# EAGLE design ESP32 (EAGLE 9.6.2)
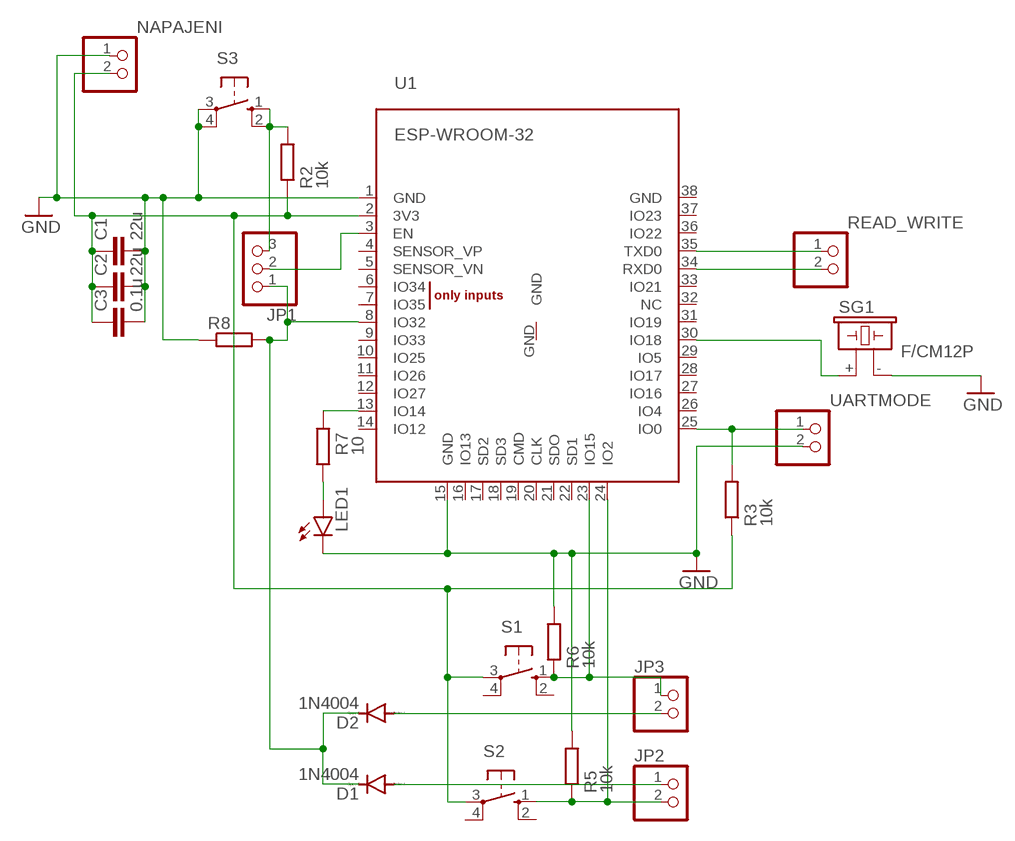
[diagram p0: schematic, sheet 1]

## Parts
C1  22u  C2.5/2  [C2.5-2]
C2  22u  C2.5/2  [C2.5-2]
C3  0.1u  C2.5/2  [C2.5-2]
D1  1N4004  [DO41-10]
D2  1N4004  [DO41-10]
JP1  PINHD-1X3  [1X03]
JP2  PINHD-1X2  [1X02]
JP3  PINHD-1X2  [1X02]
LED1  LED5MM  [LED5MM]
NAPAJENI  PINHD-1X2  [1X02]
R2  10k  R-EU_0207/10  [0207/10]
R3  10k  R-EU_0207/10  [0207/10]
R5  10k  R-EU_0207/10  [0207/10]
R6  10k  R-EU_0207/10  [0207/10]
R7  10  R-EU_0207/10  [0207/10]
R8  R-EU_0207/10  [0207/10]
READ_WRITE  PINHD-1X2  [1X02]
S1  10-XX  [B3F-10XX]
S2  10-XX  [B3F-10XX]
S3  10-XX  [B3F-10XX]
SG1  F/CM12P  [F/CM12P]
U1  ESP-WROOM-32  [ESP-WROOM-32]
UARTMODE  PINHD-1X2  [1X02]

## Nets
GND: C1.2 C2.2 C3.2 LED1.K(C) NAPAJENI.1 R5.2 R6.2 R8.1 S3.3(P) S3.4(P1) SG1.- U1.1(GND) U1.15(GND) UARTMODE.2
N$1: SG1.+ U1.30(IO18)
N$2: C1.1 C2.1 C3.1 NAPAJENI.2 R2.1 R3.1 S1.3(P) S2.3(P) U1.2(3V3)
N$3: JP1.3 R2.2 S3.1(S) S3.2(S1)
N$5: JP1.2 U1.3(EN)
N$6: READ_WRITE.2 U1.34(RXD0)
N$7: READ_WRITE.1 U1.35(TXD0)
N$8: R3.2 U1.25(IO0) UARTMODE.1
N$11: JP2.2 R5.1 S2.1(S) U1.24(IO2)
N$12: JP3.1 R6.1 S1.1(S) U1.23(IO15)
N$13: R7.2 U1.13(IO14)
N$14: LED1.A R7.1
N$15: D1.C D2.C JP1.1 R8.2 U1.8(IO32)
N$17: D1.A JP2.1
N$18: D2.A JP3.2
Unconnected: S1.2(S1) S1.4(P1) S2.2(S1) S2.4(P1) U1.4(SENSOR_VP) U1.5(SENSOR_VN) U1.6(IO34) U1.7(IO35) U1.9(IO33) U1.10(IO25) U1.11(IO26) U1.12(IO27) U1.14(IO12) U1.16(IO13) U1.17(SD2) U1.18(SD3) U1.19(CMD) U1.20(CLK) U1.21(SDO) U1.22(SD1) U1.26(IO4) U1.27(IO16) U1.28(IO17) U1.29(IO5) U1.31(IO19) U1.32(NC) U1.33(IO21) U1.36(IO22) U1.37(IO23) U1.38(GND) U1.GND

## Library data of the parts
C1-C3 = capacitor-wima:C: CAPACITOR naming: grid - package width
D1 D2 = diode:1N4004: DIODE general purpose rectifier, 1 A
JP1 = pinhead:PINHD-1X3: PIN HEADER
JP2 JP3 NAPAJENI READ_WRITE UARTMODE = pinhead:PINHD-1X2: PIN HEADER
LED1 = led:LED: LED OSRAM: - CHIPLED LG R971, LG N971, LY N971, LG Q971, LY Q971, LO R971, LY R971 LH N974, LH R974 LS Q976, LO Q976, LY Q976 LO Q996 - Hyper CHIPLED LW Q18S LB Q993, LB Q99A, LB R99A - SideLED LS A670, LO A670, LY A670, LG A670, LP A670 LB A673, LV A673, LT A673, LW A673 LH A674 LY A675 LS A676, LA A676, LO A676, LY A676, LW A676 LS A679, LY A679, LG A679 - Hyper Micro SIDELED® LS Y876, LA Y876, LO Y876, LY Y876 LT Y87S - SmartLED LW L88C, LW L88S LB L89C, LB L89S, LG L890 LS L89K, LO L89K, LY L89K LS L896, LA L896, LO L896, LY L896 - TOPLED LS T670, LO T670, LY T670, LG T670, LP T670 LSG T670, LSP T670, LSY T670, LOP T670, LYG T670 LG T671, LOG T671, LSG T671 LB T673, LV T673, LT T673, LW T673 LH T674 LS T676, LA T676, LO T676, LY T676, LB T676, LH T676, LSB T676, LW T676 LB T67C, LV T67C, LT T67C, LS T67K, LO T67K, LY T67K, LW E67C LS E67B, LA E67B, LO E67B, LY E67B, LB E67C, LV E67C, LT E67C LW T67C LS T679, LY T679, LG T679 LS T770, LO T770, LY T770, LG T770, LP T770 LB T773, LV T773, LT T773, LW T773 LH T774 LS E675, LA E675, LY E675, LS T675 LS T776, LA T776, LO T776, LY T776, LB T776 LHGB T686 LT T68C, LB T68C - Hyper Mini TOPLED® LB M676 - Mini TOPLED Santana® LG M470 LS M47K, LO M47K, LY M47K Source: http://www.osram.convergy.de LUXEON: - LUMILED® LXK2-PW12-R00, LXK2-PW12-S00, LXK2-PW14-U00, LXK2-PW14-V00 LXK2-PM12-R00, LXK2-PM12-S00, LXK2-PM14-U00 LXK2-PE12-Q00, LXK2-PE12-R00, LXK2-PE12-S00, LXK2-PE14-T00, LXK2-PE14-U00 LXK2-PB12-K00, LXK2-PB12-L00, LXK2-PB12-M00, LXK2-PB14-N00, LXK2-PB14-P00, LXK2-PB14-Q00 LXK2-PR12-L00, LXK2-PR12-M00, LXK2-PR14-Q00, LXK2-PR14-R00 LXK2-PD12-Q00, LXK2-PD12-R00, LXK2-PD12-S00 LXK2-PH12-R00, LXK2-PH12-S00 LXK2-PL12-P00, LXK2-PL12-Q00, LXK2-PL12-R00 Source: www.luxeon.com KINGBRIGHT: KA-3528ASYC Source: www.kingbright.com
R2 R3 R5-R8 = rcl:R-EU_: RESISTOR, European symbol; SPICEPREFIX: R
S1-S3 = switch-omron:10-XX: OMRON SWITCH; MPN: B3F-1000; OC_FARNELL: 176432; OC_NEWARK: 36M3542
SG1 = buzzer:F/CM12P: BUZZER Source: Buerklin; OC_FARNELL: unknown; OC_NEWARK: unknown
U1 = ESP32:ESP-WROOM-32

## Board
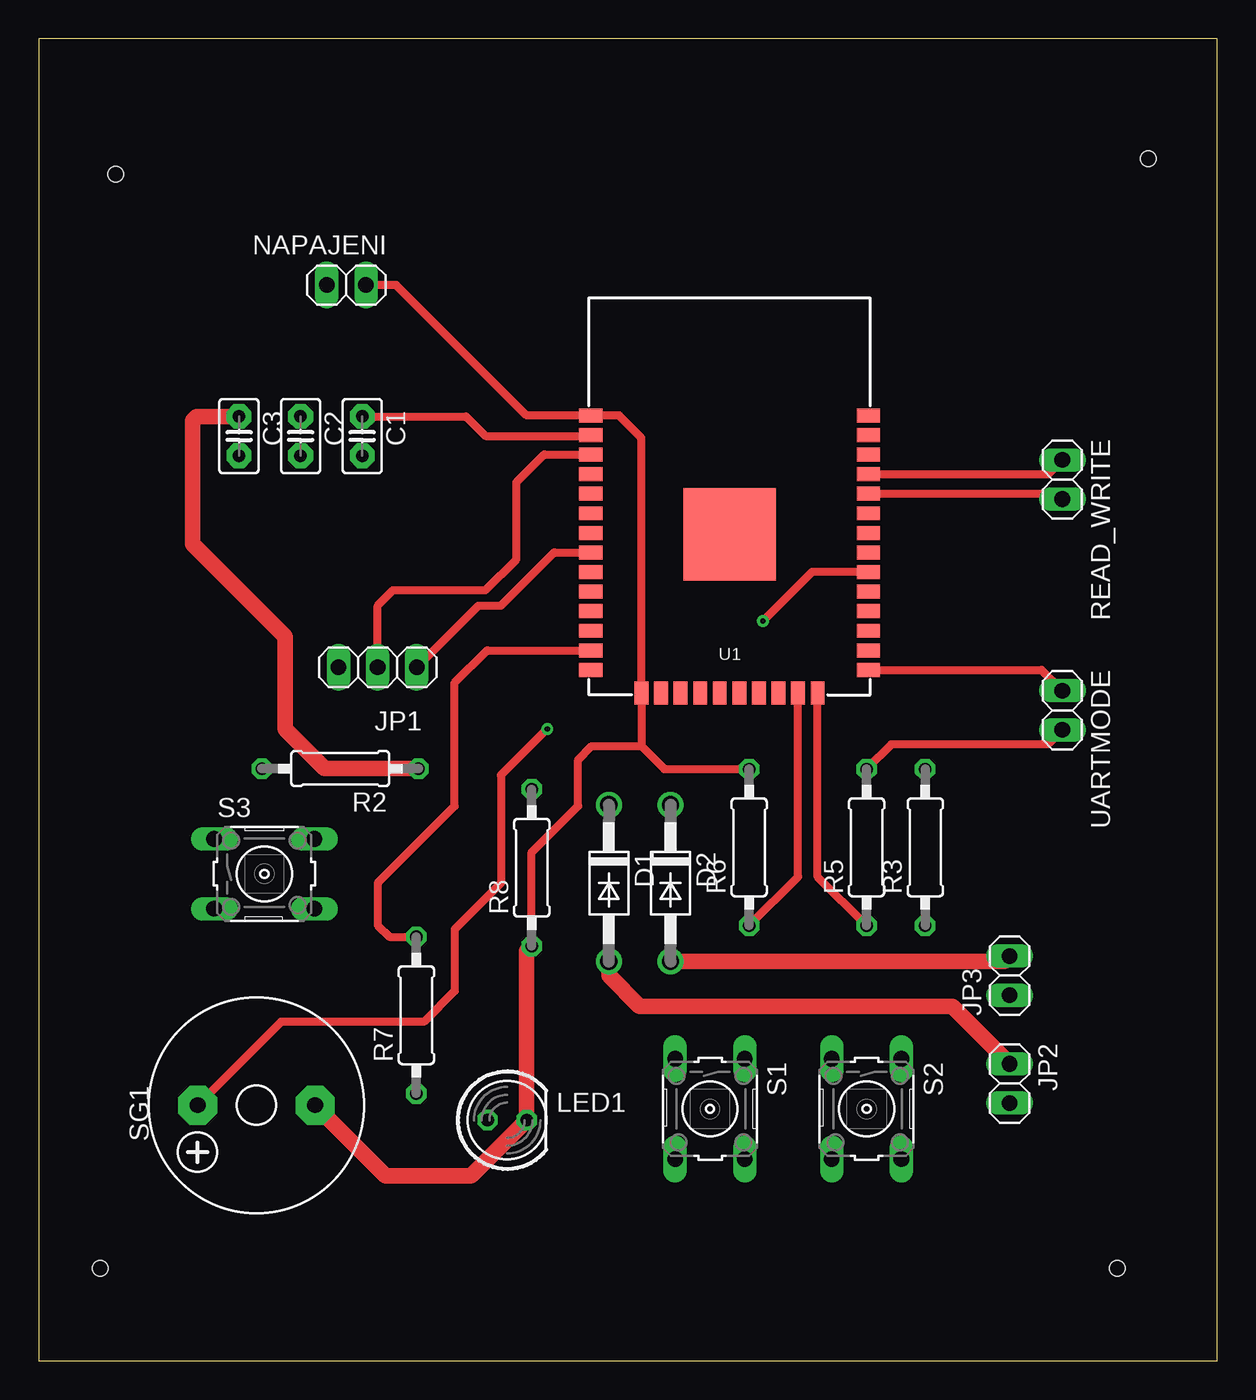
[diagram p1: board, top side]
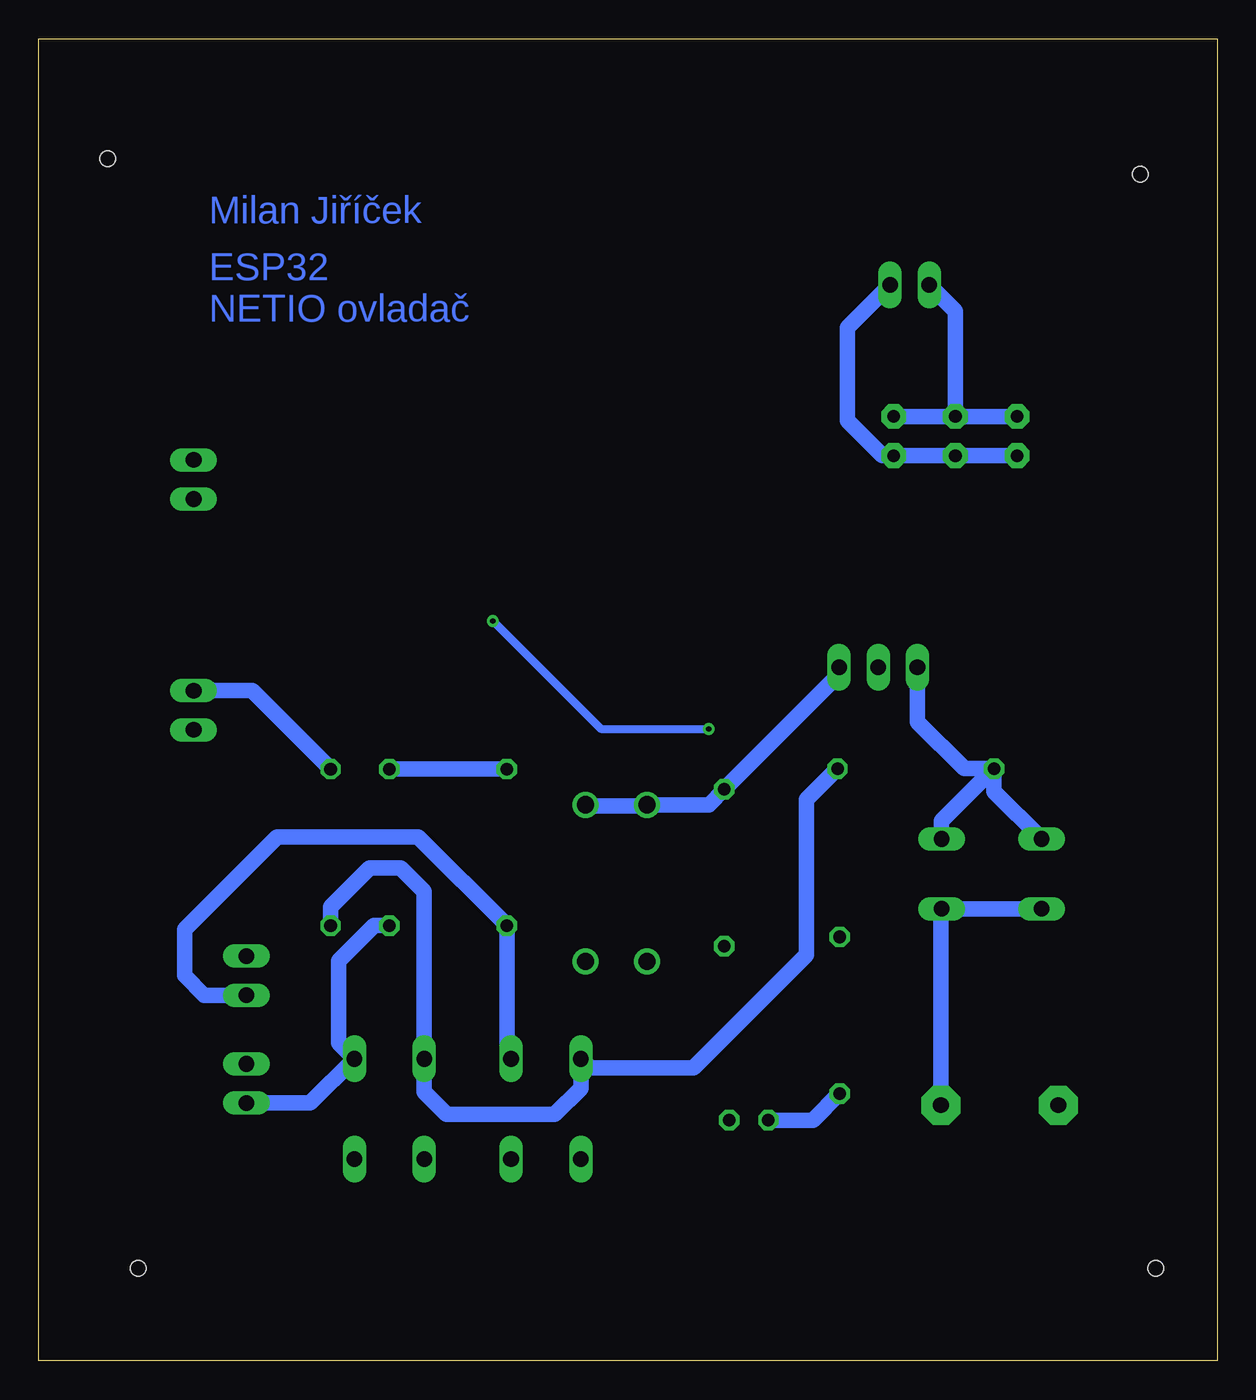
[diagram p2: board, bottom side, seen from below]

Size 76.48 x 85.79 mm. Coordinates in mm from the lower left corner, seen from the top.
Outline: 0,0 76.48,0 76.48,85.79 0,85.79 0,0
Copper layers (1*16): Top 0.035mm / dielectric 1.5mm / Bottom 0.035mm
Design rules "default": minimum track width 6mil, minimum drill 0.35mm, track to track 6mil, track to pad 6mil, pad to pad 6mil, via to via 6mil, smd to smd 6mil, copper to edge 40mil, drill to drill 6mil, minimum pad ring 10mil, minimum via ring 8mil, stop-mask expansion 4mil, vias tented up to drill 0mil, thermal gap 10mil
Holes 1 mm at 4,6 70,6 72,78 5,77

### Footprints (pad centres in the part's own frame; a part is rotated, then mirrored left to right if it is on the bottom)
C2.5-2 = drill 0.813 pad 1.6 octagon: 1 -1.27,0; 2 1.27,0
DO41-10 = drill 1.118: A 5.08,0; C -5.08,0
1X03 = drill 1.016 long: 1 -2.54,0; 2 0,0; 3 2.54,0
1X02 = drill 1.016 long: 1 -1.27,0; 2 1.27,0
LED5MM = drill 0.813 octagon: A -1.27,0; K 1.27,0
0207/10 = drill 0.813 octagon: 1 -5.08,0; 2 5.08,0
B3F-10XX = drill 1.016 long: 1 -3.251,2.261; 2 3.251,2.261; 3 -3.251,-2.261; 4 3.251,-2.261
F/CM12P = drill 1.016 pad 2.54 octagon: + 3.81,0; - -3.81,0
ESP-WROOM-32 = smd 0.9 x 1.5: 1 7.7,9; 2 6.43,9; 3 5.16,9; 4 3.89,9; 5 2.62,9; 6 1.35,9; 7 0.08,9; 8 -1.19,9; 9 -2.46,9; 10 -3.73,9; 11 -5,9; 12 -6.27,9; 13 -7.54,9; 14 -8.81,9; 25 -8.81,-9; 26 -7.54,-9; 27 -6.27,-9; 28 -5,-9; 29 -3.73,-9; 30 -2.46,-9; 31 -1.19,-9; 32 0.08,-9; 33 1.35,-9; 34 2.62,-9; 35 3.89,-9; 36 5.16,-9; 37 6.43,-9; 38 7.7,-9 | smd 1.5 x 0.9: 15 -10.3,5.715; 16 -10.3,4.445; 17 -10.3,3.175; 18 -10.3,1.905; 19 -10.3,0.635; 20 -10.3,-0.635; 21 -10.3,-1.905; 22 -10.3,-3.175; 23 -10.3,-4.445; 24 -10.3,-5.715 | smd 6 x 6: GND 0,0

### Placement (x,y rotation side)
C1  21,60 270 top
C2  17,60 270 top
C3  13,60 270 top
D1  37,31 270 top
D2  41,31 270 top
JP1  22,45 180 top
JP2  63,18 270 top
JP3  63,25 90 top
LED1  30.4,15.62 0 top
NAPAJENI  19.97,69.8 180 top
R2  19.57,38.43 180 top
R3  57.53,33.32 90 top
R5  53.72,33.32 90 top
R6  46.1,33.32 90 top
R7  24.51,22.43 90 top
R8  32,32 90 top
READ_WRITE  66.42,57.18 270 top
S1  43.56,16.35 270 top
S2  53.72,16.35 270 top
S3  14.65,31.6 0 top
SG1  14.13,16.59 180 top
U1  44.83,53.64 90 top
UARTMODE  66.42,42.21 270 top

### Tracks (layer width: path | path; a pad name or v marks a point on that pad's centre or on a via)
GND
  Top 0.508: UARTMODE.2 65.48,40 55.32,40 R5.2 | 39.12,39.89 U1.15 39.12,59.88 37.66,61.34 U1.1 31.66,61.34 23.2,69.8 NAPAJENI.1 | R6.2 40.6,38.4 39.12,39.89 | 39.12,39.89 35.88,39.89 35,39 35,36 32,33 R8.1 31.67,26.59
  Top 1.016: 31.67,26.59 LED1.K 28.05,12 22.53,12 SG1.-
  Bottom 1.016: R6.2 R5.2 | 17.67,29.11 S3.4 | S3.4 S3.3 | S3.4 17.94,29.3 SG1.- | C3.2 C2.2 C1.2 21.73,58.73 24,61 24,67.04 NAPAJENI.1
N$1  (via drill 0.35)
  Top 0.508: U1.30 50.18,51.18 v47,48 | v33,41 30,38 30,31 27,28 27,24 25,22 15.73,22 SG1.+
  Bottom 0.508: v47,48 40,41 v33,41
N$2
  Top 0.508: C1.1 27.73,61.27 29,60 35.76,60 U1.2
  Top 1.016: 18.43,69.53 NAPAJENI.2 | R2.1 18.57,38.43 16,41 16,47 10,53 10,61 10.27,61.27 C3.1
  Bottom 1.016: R3.1 57.53,29.47 55,32 53,32 51.46,30.46 S2.3 51.46,17.46 50,16 43,16 41.3,17.7 S1.3 40.7,19 34,19 26.65,26.35 26.65,36.43 R2.1 | C1.1 C2.1 | C2.1 C3.1 | C2.1 17,68.1 NAPAJENI.2
N$3
  Bottom 1.016: JP1.3 19.46,41.46 16.43,38.43 R2.2 | S3.1 14.49,36.95 R2.2 | S3.2 17.9,35.02 R2.2
N$5
  Top 0.508: JP1.2 22,49 23,50 29,50 31,52 31,57 32.8,58.8 U1.3
N$6
  Top 0.508: U1.34 66.07,56.26 READ_WRITE.2
N$7
  Top 0.508: U1.35 65.5,57.53 READ_WRITE.1
N$8
  Top 0.508: U1.25 65.07,44.83 UARTMODE.1
  Bottom 1.016: R3.2 62.61,43.48 UARTMODE.1
N$11
  Top 0.508: R5.1 50.55,31.41 U1.24
  Bottom 1.016: R5.1 54.72,28.24 57,25.96 57,20.62 S2.1 58.85,16.73 JP2.2
N$12
  Top 0.508: R6.1 49.27,31.41 U1.23
  Bottom 1.016: S1.1 46.1,19.88 R6.1 51.86,34 61,34 67,28 67,25 65.73,23.73 JP3.1
N$13
  Top 0.508: U1.13 29.1,46.1 27,44 27,36 22,31 22,28.27 22.76,27.51 R7.2
N$14
  Bottom 1.016: LED1.A 26.24,15.62 R7.1
N$15
  Top 0.508: U1.8 33.45,52.45 30,49 28.54,49 JP1.1
  Bottom 1.016: D2.C 40.92,36 36.92,36 D1.C 33,36.08 R8.2 24.54,44.54 JP1.1
N$17
  Top 1.016: JP2.1 59.27,23 39,23 37,25 D1.A
N$18
  Top 1.016: D2.A 62.65,25.92 JP3.2

### Text on the board
Bottom: Milan Jiříček | ESP32 / NETIO ovladač